# EAGLE schematic pulse_generator (EAGLE 7.5.0)
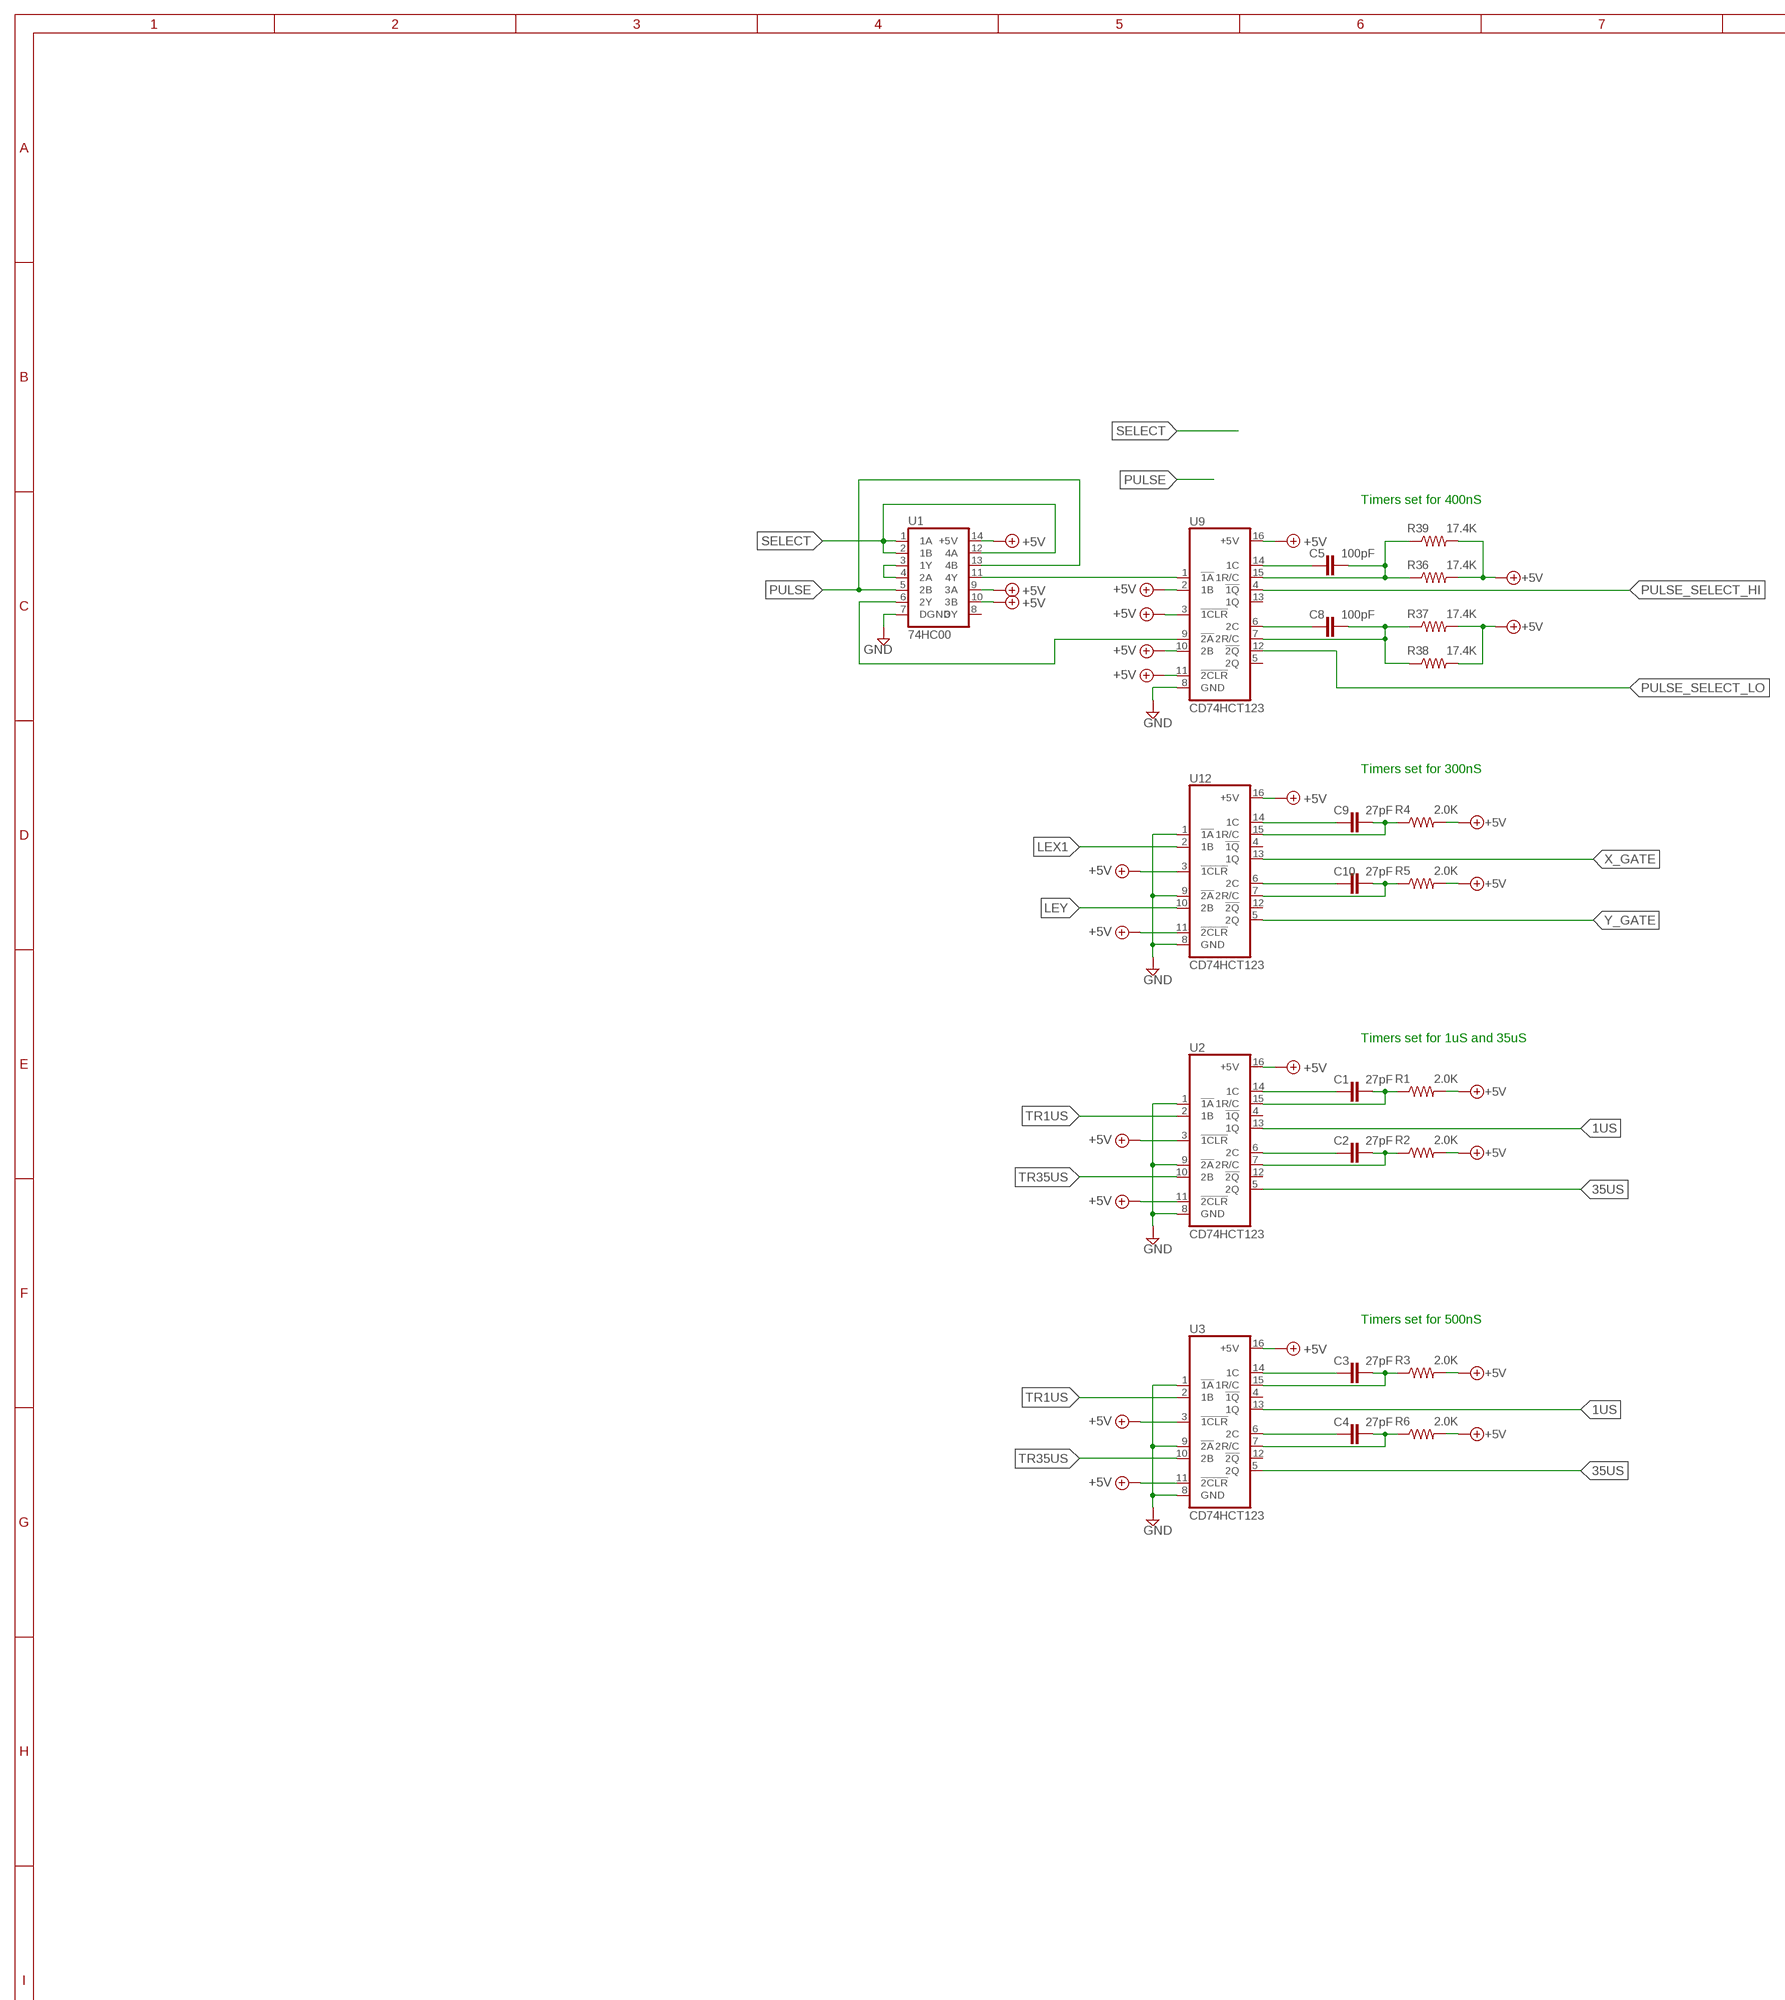
[diagram p0: schematic, sheet 1, part 1 of 2]
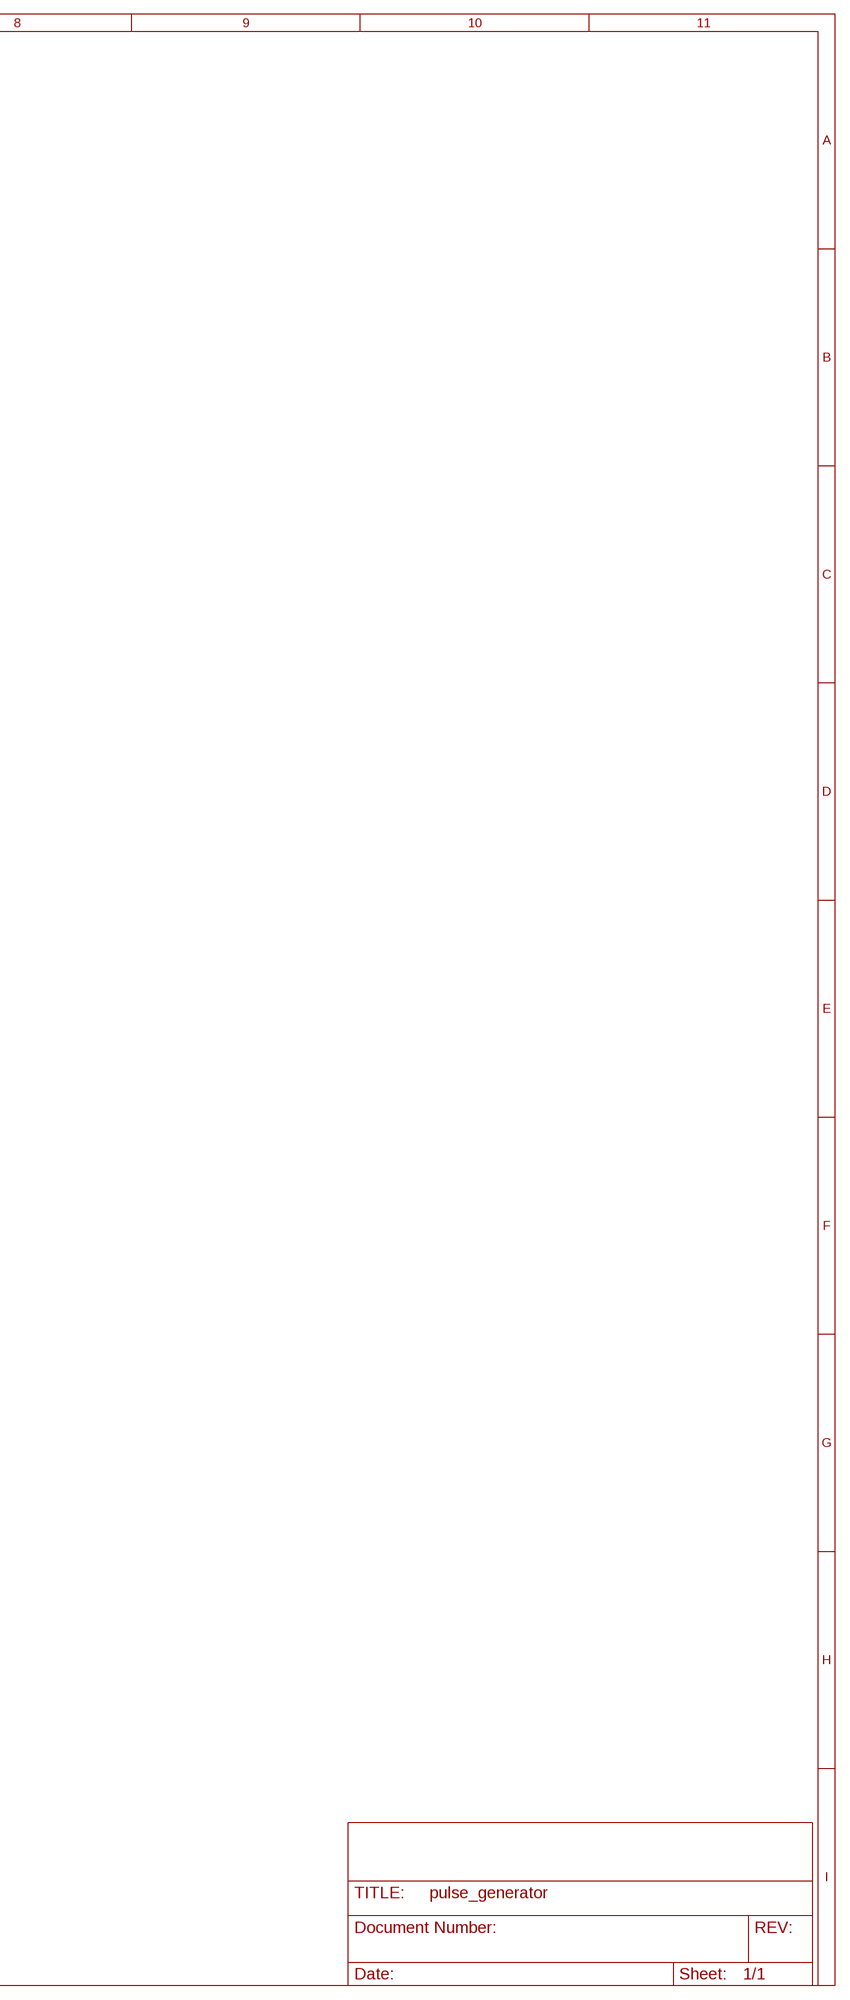
[diagram p1: schematic, sheet 1, part 2 of 2]

## Parts
C1  27pF  C-0.1  [C2.5]
C2  27pF  C-0.1  [C2.5]
C3  27pF  C-0.1  [C2.5]
C4  27pF  C-0.1  [C2.5]
C5  100pF  C-0.1  [C2.5]
C8  100pF  C-0.1  [C2.5]
C9  27pF  C-0.1  [C2.5]
C10  27pF  C-0.1  [C2.5]
R1  2.0K  R-1/4WATT  [0207/10]
R2  2.0K  R-1/4WATT  [0207/10]
R3  2.0K  R-1/4WATT  [0207/10]
R4  2.0K  R-1/4WATT  [0207/10]
R5  2.0K  R-1/4WATT  [0207/10]
R6  2.0K  R-1/4WATT  [0207/10]
R36  17.4K  R-1/4WATT  [0207/10]
R37  17.4K  R-1/4WATT  [0207/10]
R38  17.4K  R-1/4WATT  [0207/10]
R39  17.4K  R-1/4WATT  [0207/10]
U1  74HC00  CD74HC00  [DIP-14]
U2  CD74HCT123  [DIP-16]
U3  CD74HCT123  [DIP-16]
U9  CD74HCT123  [DIP-16]
U12  CD74HCT123  [DIP-16]

## Nets
1US: U2.13(1Q) U3.13(1Q)
35US: U2.5(2Q) U3.5(2Q)
+5V: R1.2 R2.2 R3.2 R4.2 R5.2 R6.2 R36.2 R37.2 R38.2 R39.2 U1.9(3A) U1.10(3B) U1.14(+5V) U2.3(!1CLR) U2.11(!2CLR) U2.16(+5V) U3.3(!1CLR) U3.11(!2CLR) U3.16(+5V) U9.2(1B) U9.3(!1CLR) U9.10(2B) U9.11(!2CLR) U9.16(+5V) U12.3(!1CLR) U12.11(!2CLR) U12.16(+5V)
GND: U1.7(DGND) U2.1(!1A) U2.8(GND) U2.9(!2A) U3.1(!1A) U3.8(GND) U3.9(!2A) U9.8(GND) U12.1(!1A) U12.8(GND) U12.9(!2A)
LEX1: U12.2(1B)
LEY1: U12.10(2B)
N$1: C1.2 R1.1 U2.15(1R/C)
N$2: C9.2 R4.1 U12.15(1R/C)
N$3: C1.1 U2.14(1C)
N$4: C2.2 R2.1 U2.7(2R/C)
N$5: C2.1 U2.6(2C)
N$6: C3.2 R3.1 U3.15(1R/C)
N$7: C3.1 U3.14(1C)
N$8: C4.2 R6.1 U3.7(2R/C)
N$9: C4.1 U3.6(2C)
N$24: U1.11(4Y) U9.1(!1A)
N$26: U1.6(2Y) U9.9(!2A)
N$27: U1.3(1Y) U1.4(2A)
N$33: C9.1 U12.14(1C)
N$37: C10.2 R5.1 U12.7(2R/C)
N$39: C5.1 U9.14(1C)
N$41: C5.2 R36.1 R39.1 U9.15(1R/C)
N$43: C8.2 R37.1 R38.1 U9.7(2R/C)
N$48: C10.1 U12.6(2C)
N$52: C8.1 U9.6(2C)
PULSE: U1.5(2B) U1.13(4B)
PULSE_SELECT_HI: U9.4(!1Q)
PULSE_SELECT_LO: U9.12(!2Q)
SELECT: U1.1(1A) U1.2(1B) U1.12(4A)
TR1US: U2.2(1B) U3.2(1B)
TR35US: U2.10(2B) U3.10(2B)
X_GATE: U12.13(1Q)
Y_GATE: U12.5(2Q)
Unconnected: U1.8(3Y) U2.4(!1Q) U2.12(!2Q) U3.4(!1Q) U3.12(!2Q) U9.5(2Q) U9.13(1Q) U12.4(!1Q) U12.12(!2Q)

## Notes on the sheet
- Timers set for 400nS
- Timers set for 300nS
- Timers set for 1uS and 35uS
- Timers set for 500nS

## Library data of the parts
C1-C5 C8-C10 = keiths:C-0.1: Through hole radial capacitor. 0.1 inch lead to lead.
R1-R6 R36-R39 = keiths:R-1/4WATT: Quarter watt through hole resistor.
U1 = keiths:CD74HC00: Quad 2-Input NAND Gate
U2 U3 U9 U12 = keiths:CD74HCT123: High-Speed CMOS Logic Dual Retriggerable Monostable Multivibrator